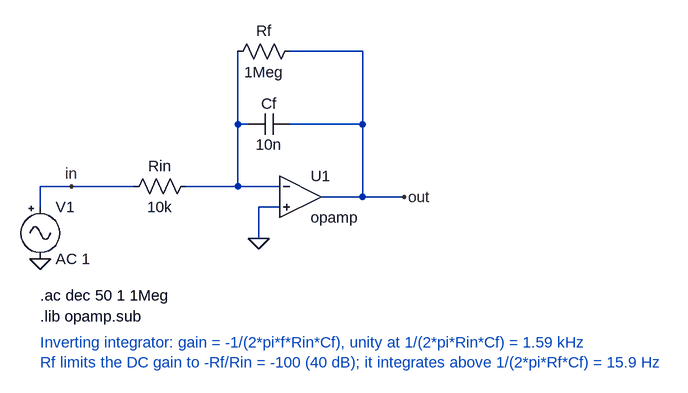
[diagram p0: schematic integrator.asc]
integrator.asc, the LTspice schematic file:
Version 4
SHEET 1 880 680
WIRE 336 -64 336 144
WIRE 528 -64 416 -64
WIRE 528 160 528 -64
WIRE 352 48 336 48
WIRE 528 48 416 48
WIRE 32 144 32 176
WIRE 176 144 32 144
WIRE 400 144 256 144
WIRE 368 176 400 176
WIRE 368 224 368 176
WIRE 592 160 464 160
FLAG 32 256 0
FLAG 368 224 0
FLAG 80 144 in
FLAG 592 160 out
SYMBOL Misc\signal 32 160 R0
SYMATTR InstName V1
SYMATTR Value AC 1
SYMBOL res 272 128 R90
WINDOW 0 0 56 VBottom 2
WINDOW 3 32 56 VTop 2
SYMATTR InstName Rin
SYMATTR Value 10k
SYMBOL cap 416 32 R90
WINDOW 0 0 32 VBottom 2
WINDOW 3 32 32 VTop 2
SYMATTR InstName Cf
SYMATTR Value 10n
SYMBOL res 432 -80 R90
WINDOW 0 0 56 VBottom 2
WINDOW 3 32 56 VTop 2
SYMATTR InstName Rf
SYMATTR Value 1Meg
SYMBOL OpAmps\opamp 432 96 R0
SYMATTR InstName U1
TEXT 32 312 Left 2 !.ac dec 50 1 1Meg
TEXT 32 344 Left 2 !.lib opamp.sub
TEXT 32 384 Left 2 ;Inverting integrator: gain = -1/(2*pi*f*Rin*Cf), unity at 1/(2*pi*Rin*Cf) = 1.59 kHz\nRf limits the DC gain to -Rf/Rin = -100 (40 dB); it integrates above 1/(2*pi*Rf*Cf) = 15.9 Hz

The netlist it stands for:
* integrator.asc
V1 in 0 AC 1
Rin N001 in 10k
Cf out N001 10n
Rf out N001 1Meg
XU1 N001 0 out opamp Aol=100K GBW=10Meg  ; pins invin noninvin out
.ac dec 50 1 1Meg
.lib opamp.sub
* Inverting integrator: gain = -1/(2*pi*f*Rin*Cf), unity at 1/(2*pi*Rin*Cf) = 1.59 kHz
* Rf limits the DC gain to -Rf/Rin = -100 (40 dB); it integrates above 1/(2*pi*Rf*Cf) = 15.9 Hz
.backanno
.end